# Altium project minesweeper-mainboard.PrjPcb
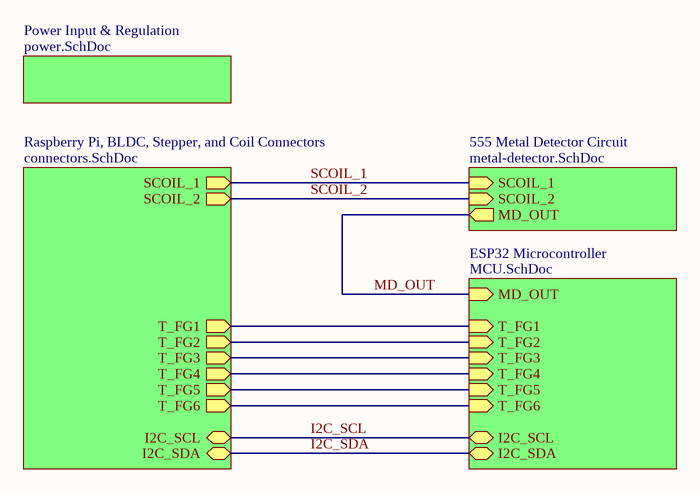
[diagram p0: root.SchDoc]
5 sheets, 137 parts. Net scope: hierarchical (ports join the sheet entries above them; power ports are global).
Board file: mainboard.PcbDoc
Sheets:
  root.SchDoc
    Power Input & Regulation = power.SchDoc
    Raspberry Pi, BLDC, Stepper, and Coil Connectors = connectors.SchDoc
    555 Metal Detector Circuit = metal-detector.SchDoc
    ESP32 Microcontroller = MCU.SchDoc

## Sheet root.SchDoc
size A4; SheetNumber: 1; SheetTotal: 5

### Sub-sheets
555 Metal Detector Circuit = metal-detector.SchDoc: SCOIL_2 (in), MD_OUT (out), SCOIL_1 (in)
ESP32 Microcontroller = MCU.SchDoc: MD_OUT (in), I2C_SCL (bidir), I2C_SDA (bidir), T_FG1 (in), T_FG2 (in), T_FG3 (in), T_FG4 (in), T_FG5 (in), T_FG6 (in)
Power Input & Regulation = power.SchDoc: no entries
Raspberry Pi, BLDC, Stepper, and Coil Connectors = connectors.SchDoc: SCOIL_1 (out), SCOIL_2 (out), I2C_SCL (bidir), I2C_SDA (bidir), T_FG1 (out), T_FG2 (out), T_FG3 (out), T_FG4 (out), T_FG5 (out), T_FG6 (out)

### Nets
I2C_SCL: sheet Raspberry Pi, BLDC, Stepper, and Coil Connectors/I2C_SCL, sheet ESP32 Microcontroller/I2C_SCL
I2C_SDA: sheet Raspberry Pi, BLDC, Stepper, and Coil Connectors/I2C_SDA, sheet ESP32 Microcontroller/I2C_SDA
MD_OUT: sheet 555 Metal Detector Circuit/MD_OUT, sheet ESP32 Microcontroller/MD_OUT
SCOIL_1: sheet Raspberry Pi, BLDC, Stepper, and Coil Connectors/SCOIL_1, sheet 555 Metal Detector Circuit/SCOIL_1
SCOIL_2: sheet Raspberry Pi, BLDC, Stepper, and Coil Connectors/SCOIL_2, sheet 555 Metal Detector Circuit/SCOIL_2
T_FG1: sheet Raspberry Pi, BLDC, Stepper, and Coil Connectors/T_FG1, sheet ESP32 Microcontroller/T_FG1
T_FG2: sheet Raspberry Pi, BLDC, Stepper, and Coil Connectors/T_FG2, sheet ESP32 Microcontroller/T_FG2
T_FG3: sheet Raspberry Pi, BLDC, Stepper, and Coil Connectors/T_FG3, sheet ESP32 Microcontroller/T_FG3
T_FG4: sheet Raspberry Pi, BLDC, Stepper, and Coil Connectors/T_FG4, sheet ESP32 Microcontroller/T_FG4
T_FG5: sheet Raspberry Pi, BLDC, Stepper, and Coil Connectors/T_FG5, sheet ESP32 Microcontroller/T_FG5
T_FG6: sheet Raspberry Pi, BLDC, Stepper, and Coil Connectors/T_FG6, sheet ESP32 Microcontroller/T_FG6

## Sheet power.SchDoc
size A4; SheetNumber: 2; SheetTotal: 5
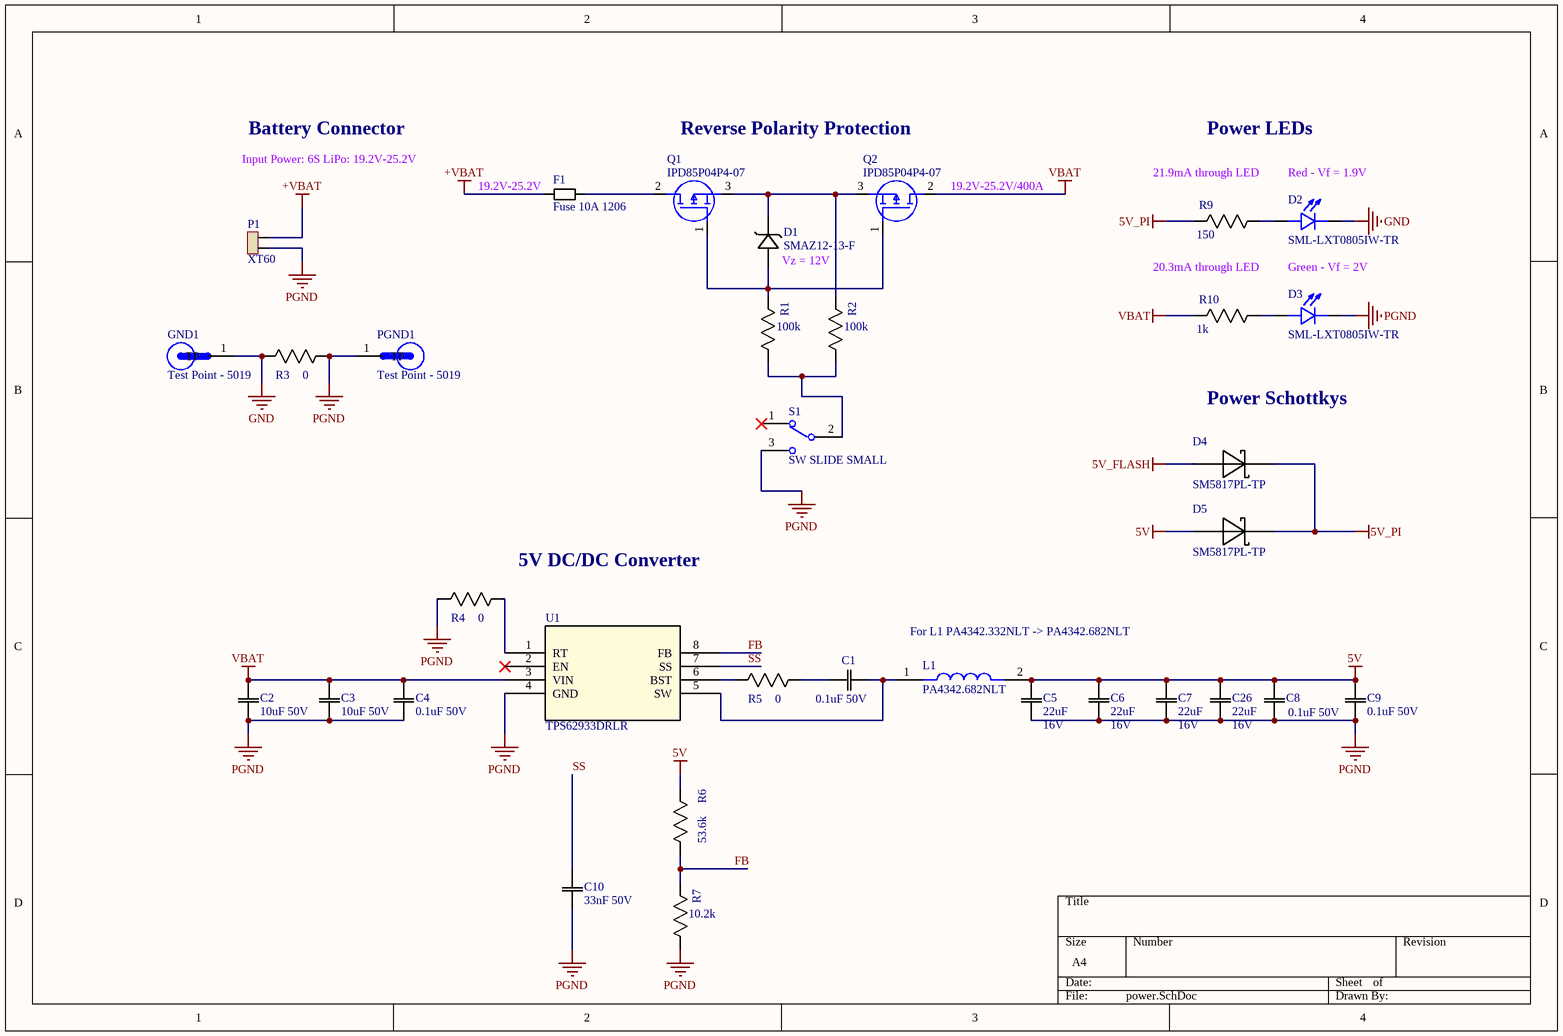
[diagram p1: power.SchDoc]

### Parts
C1  0.1uF 50V  [0805]
C2  10uF 50V  [0805]
C3  10uF 50V  [0805]
C4  0.1uF 50V  [0805]
C5  Rating: 16V  [0805]  (hidden comment: 22uF)
C6  Rating: 16V  [0805]  (hidden comment: 22uF)
C7  Rating: 16V  [0805]  (hidden comment: 22uF)
C8  0.1uF 50V  [0805]
C9  0.1uF 50V  [0805]
C10  33nF 50V  [0805]
C26  Rating: 16V  [0805]  (hidden comment: 22uF)
D1  SMAZ12-13-F  [SMA_DIO-L]
D2  SML-LXT0805IW-TR  [LEDC2012X120N]
D3  SML-LXT0805IW-TR  [LEDC2012X120N]
D4  SM5817PL-TP  [SOD-123]
D5  SM5817PL-TP  [SOD-123]
F1  Fuse 10A 1206  [1206]
GND1  Test Point - 5019  [TP380X203]
L1  PA4342.682NLT  [IND_PA4342.332NLT]
P1  XT60  [Amass_XT60PW-M]
PGND1  Test Point - 5019  [TP380X203]
Q1  IPD85P04P4-07  [DPAK (TO-252)]
Q2  IPD85P04P4-07  [DPAK (TO-252)]
R1  100k  [0805]
R2  100k  [0805]
R3  0  [0805]
R4  0  [0805]
R5  0  [0805]
R6  53.6k  [0805]
R7  10.2k  [0805]
R9  150  [0805]
R10  1k  [0805]
S1  SW SLIDE SMALL  [SW SLIDE SMALL]
U1  TPS62933DRLR  [SOT_33DRLR_TEX]

### Nets
5V: C5.2(C2) C6.2(C2) C7.2(C2) C8.2(C2) C9.2(C2) C26.2(C2) D5.A L1.2 R6.2(R2)
5V_FLASH: D4.A
5V_PI: D4.C(K) D5.C(K) R9.2(R2)
+VBAT: F1.1 P1.2
GND: D2.C GND1.1(TP) R3.2(R2)
PGND: C2.1(C1) C3.1(C1) C4.1(C1) C5.1(C1) C6.1(C1) C7.1(C1) C8.1(C1) C9.1(C1) C10.1(C1) C26.1(C1) D3.C P1.1 PGND1.1(TP) R3.1(R1) R4.2(R2) R7.1(R1) S1.3 U1.4(GND)
VBAT: C2.2(C2) C3.2(C2) C4.2(C2) Q2.2(D) R10.2(R2) U1.3(VIN)
FB: R6.1(R1) R7.2(R2) U1.8(FB)
SS: C10.2(C2) U1.7(SS)
NetC1_1: C1.1(C1) L1.1 U1.5(SW)
NetC1_2: C1.2(C2) R5.1(R1)
NetD1_1: D1.1 Q1.3(S) Q2.3(S) R2.2(R2)
NetD1_2: D1.2 Q1.1(G) Q2.1(G) R1.2(R2)
NetD2_A: D2.A R9.1(R1)
NetD3_A: D3.A R10.1(R1)
NetF1_2: F1.2 Q1.2(D)
NetR1_1: R1.1(R1) R2.1(R1) S1.2
NetR4_1: R4.1(R1) U1.1(RT)
NetR5_2: R5.2(R2) U1.6(BST)

Not connected (* = marked no-connect by the designer): S1 1*; U1 2(EN)*

### Notes on the sheet
- Input Power: 6S LiPo: 19.2V-25.2V
- Battery Connector
- Reverse Polarity Protection
- 21.9mA through LED
- Power LEDs
- Red - Vf = 1.9V
- (near F1) 19.2V-25.2V
- (near Q2) 19.2V-25.2V/400A
- (near D1) Vz = 12V
- 20.3mA through LED
- Green - Vf = 2V
- Power Schottkys
- (near R4) 5V DC/DC Converter
- For L1 PA4342.332NLT -> PA4342.682NLT

### Library data of the parts
C1 C4 C8 C9 = CAP 10uF 50V: Default Symbol for Capacitors; Manufacturer Part Number 1: GRM21BR61H106KE43L; Value: 10uF; Temperature Coefficient: X5R; Tolerance: 10%; Part Number: CAP 10uF 50V; Supplier 1: Digi-Key; Supplier Part Number 1: 490-18663-1-ND; Manufacturer Part Number 2: CL32B106KBJNNWE; Supplier 2: Digi-Key; Supplier Part Number 2: 1276-3388-1-ND; Rating: 50V
C2 C3 = CAP 10uF 50V: Default Symbol for Capacitors; Manufacturer Part Number 1: GRM21BR61H106KE43L; Temperature Coefficient: X5R; Tolerance: 10%; Part Number: CAP 10uF 50V; Supplier 1: Digi-Key; Supplier Part Number 1: 490-18663-1-ND; Manufacturer Part Number 2: CL32B106KBJNNWE; Supplier 2: Digi-Key; Supplier Part Number 2: 1276-3388-1-ND; Value: 10uF; Rating: 50V
C5-C7 C26 = CAP 22uF 16V: CAP CER 22UF 16V X5R 0805; Tolerance: 10%; Package: 0805; Temperature Coefficient: X5R; Operating Temperature: -55°C ~ 85°C; Value: 22uF; Part Number: CAP 22uF 16V
C10 = CAP 33nF 50V: Default Symbol for Capacitors; Tolerance: 5%; Part Number: CAP 33nF 50V; Value: 33nF; Rating: 50V
D1 = DIODE ZENER 12V 1W: Zener Diode 12 V 1 W ±5% Surface Mount SMA; Mfr_Name: Diodes Inc; Type: DEV; Copyright: Copyright (C) 2021 Ultra Librarian. All rights reserved.; Manufacturer_Part_Number: SMAZ12-13-F; Digi-Key_Part_Number_1: SMAZ12-FDICT-ND; Digi-Key_Part_Number_2: SMAZ12-FDIDKR-ND; Digi-Key_Part_Number_3: SMAZ12-FDITR-ND; RefDes: RefDes; Supplier 1: Digi-Key; Supplier 2: Newark; Supplier 3: Digi-Key; Supplier Part Number 1: SMAZ12-FDICT-ND; Supplier Part Number 2: 23T8541; Supplier Part Number 3: SMAZ12-FDICT-ND; Part Number: DIODE ZENER 12V 1W; Manufacturer Part Number 1: SMAZ12-13-F; Supplier URL 1: https://www.digikey.com/en/products/detail/SMAZ12-13-F/SMAZ12-FDICT-ND/725073?curr=usd&utm_campaign=buynow&utm_medium=aggregator&utm_source=octopart
D2 D3 = SML-LXT0805IW-TR: LED;Red;11mcd;0.061In.Dia.;SMD;100mA;2V Vf;635nm;140deg;SMD;White Diffused;5V Vr | Lumex SML-LXT0805IW-TR; MF: Lumex Opto/Components; SnapEDA_Link: https://www.snapeda.com/parts/SML-LXT0805IW-TR/Lumex+Opto%252FComponents+Inc./view-part/?ref=snap; Package: 0805 Lumex; Value: *; MP: SML-LXT0805IW-TR; Check_prices: https://www.snapeda.com/parts/SML-LXT0805IW-TR/Lumex+Opto%252FComponents+Inc./view-part/?ref=eda
D4 D5 = DIODE SCHOTTKY 20V 1A: Diode Schottky 20V 1A Surface Mount SOD-123FL; MF: Micro Commercial Co; ComponentLink1Description: digikey; ComponentLink1URL: https://www.digikey.ca/product-detail/en/on-semiconductor/MBR0540T1G/MBR0540T1GOSCT-ND/917967; Digikey: SM5817PL-TPMSCT-ND; Digikey Link: https://www.digikey.ca/product-detail/en/micro-commercial-co/SM5817PL-TP/SM5817PL-TPMSCT-ND/1793410; MP: SM5817PL-TP; Voltage Rating: 20V; Package: SOD-123; Current Rating: 1A; Part Number: DIODE SCHOTTKY 20V 1A; Supplier URL 1: https://www.digikey.ca/product-detail/en/on-semiconductor/MBR0540T1G/MBR0540T1GOSCT-ND/917967; Pin Count: 2
F1 = FUSE 10A 63V SLOW: FUSE 10A 32V AC 63V DC 1206; Response Time: Slow Blow; Rating: 10A; Voltage Rating - DC: 63V; Operating Temperature: -55°C ~ 90°C; Part Number: FUSE 10A 63V SLOW; Pin Count: 2
GND1 PGND1 = Test Point - 5019: PC Test Point, Miniature Phosphor Bronze, Silver Plating Surface Mount Mounting Type; MP: 5019; MF: Keystone Electronics; Value: *; Package: 2010 Keystone; Part Number: Test Point - 5019
L1 = PA4342.332NLT: FIXED IND 6.8UH 8.5A 23.3MOHM SM; MF: Pulse; Package: Nonstandard Pulse; Price: None; Check_prices: https://www.snapeda.com/parts/PA4342.332NLT/Pulse/view-part/?ref=eda; Value: *; SnapEDA_Link: https://www.snapeda.com/parts/PA4342.332NLT/Pulse/view-part/?ref=snap; MP: PA4342.332NLT; Availability: In Stock; Purchase-URL: https://pricing.snapeda.com/search/part/PA4342.332NLT/?ref=eda
P1 = XT60 Connector: XT60 CONNECTORS FEMALE PAIR; MF: SparkFun Electronics; MP: PRT-10474; Digikey: 1568-1816-ND; Digikey Link: https://www.digikey.ca/product-detail/en/sparkfun-electronics/PRT-10474/1568-1816-ND/8258064; Package: XT60; Price: 2.13000 CAD; Value: N/A; Supplier 1: Digi-Key; Supplier Part Number 1: 1568-1816-ND; Part Number: XT60 Connector; Supplier URL 1: https://www.digikey.ca/product-detail/en/sparkfun-electronics/PRT-10474/1568-1816-ND/8258064; Pin Count: 2
Q1 Q2 = MOSFET IPD85P04P4-07: P-Channel 40 V 85A (Tc) 88W (Tc) Surface Mount PG-TO252-3-313; Supplier 1: Digi-Key; Supplier 2: Mouser; Supplier 3: Digi-Key; Supplier Part Number 1: 448-IPD85P04P407ATMA1CT-ND; Supplier Part Number 2: 726-IPD85P04P4-07; Supplier Part Number 3: 448-IPD85P04P407ATMA1CT-ND; Part Number: MOSFET IPD85P04P4-07; Supplier URL 1: https://www.digikey.ca/en/products/detail/infineon-technologies/IPD85P04P407ATMA1/5960266
R1 R2 = RES 100k 1/8W - 1%: Default Resistor Symbol; Manufacturer Part Number 1: ERJ-H3GJ104V; Power (Watts): 0.125W; Tolerance: 1%; Package: 0805; Value: 100k; Part Number: RES 100k 1/8W - 1%; Supplier 1: Digi-Key; Supplier Part Number 1: 10-ERJ-H3GJ104VCT-ND; Supplier URL 1: https://www.digikey.ca/en/products/detail/panasonic-electronic-components/ERJ-H3GJ104V/13877854?s=N4IgTCBcDaIIwAYC0BRASgKSQCQMwHENEAWANQGEAVJAOQBEQBdAXyA
R3-R5 = RES 0 JUMPER 0603: Default Resistor Symbol; Power (Watts): 0.125W; Package: 0805; Tolerance: N/A; Value: 0; Part Number: RES 0 JUMPER 0603
R6 = RES 56.2k 1/10W: Default Resistor Symbol; Value: 1; Power (Watts): 0.125W; Tolerance: 5%; Package: 0805; Part Number: RES 56.2k 1/10W
R7 = RES 10.2k 1/8W: Default Resistor Symbol; Power (Watts): 0.125W; Tolerance: 5%; Package: 0805; Value: 10.2k; Part Number: RES 10.2k 1/8W
R9 = RES 150.0 1/8W: Default Resistor Symbol; Value: 1; Power (Watts): 0.125W; Tolerance: 5%; Package: 0805; Part Number: RES 150.0 1/8W
R10 = RES 1.1k 1/8W: Default Resistor Symbol; Value: 1; Power (Watts): 0.125W; Tolerance: 5%; Package: 0805; Part Number: RES 1.1k 1/8W
S1 = SW SLIDE SMALL: Slide Switch SPDT Surface Mount, Right Angle; Manufacturer Part Number 1: JS102011SAQN SPDT; MF: C&K; MP: JS102011SAQN; Availability: Unavailable; Price: None; SnapEDA_Link: https://www.snapeda.com/parts/JS102011SAQN/C%26K/view-part/214325/?ref=snap; Value: *; Package: None; Part Number: SW SLIDE SMALL; Supplier 1: Digi-key; Supplier Part Number 1: JS102011SAQN SPDT; Supplier URL 1: https://www.digikey.ca/en/products/detail/c-k/JS102011SAQN/1640095
U1 = XTPS62933DRLR: No Description Available; Mfr_Name: Texas Instruments; RefDes: RefDes; Type: Type

## Sheet connectors.SchDoc
size 431 x 279 mm; SheetNumber: 4; SheetTotal: 5
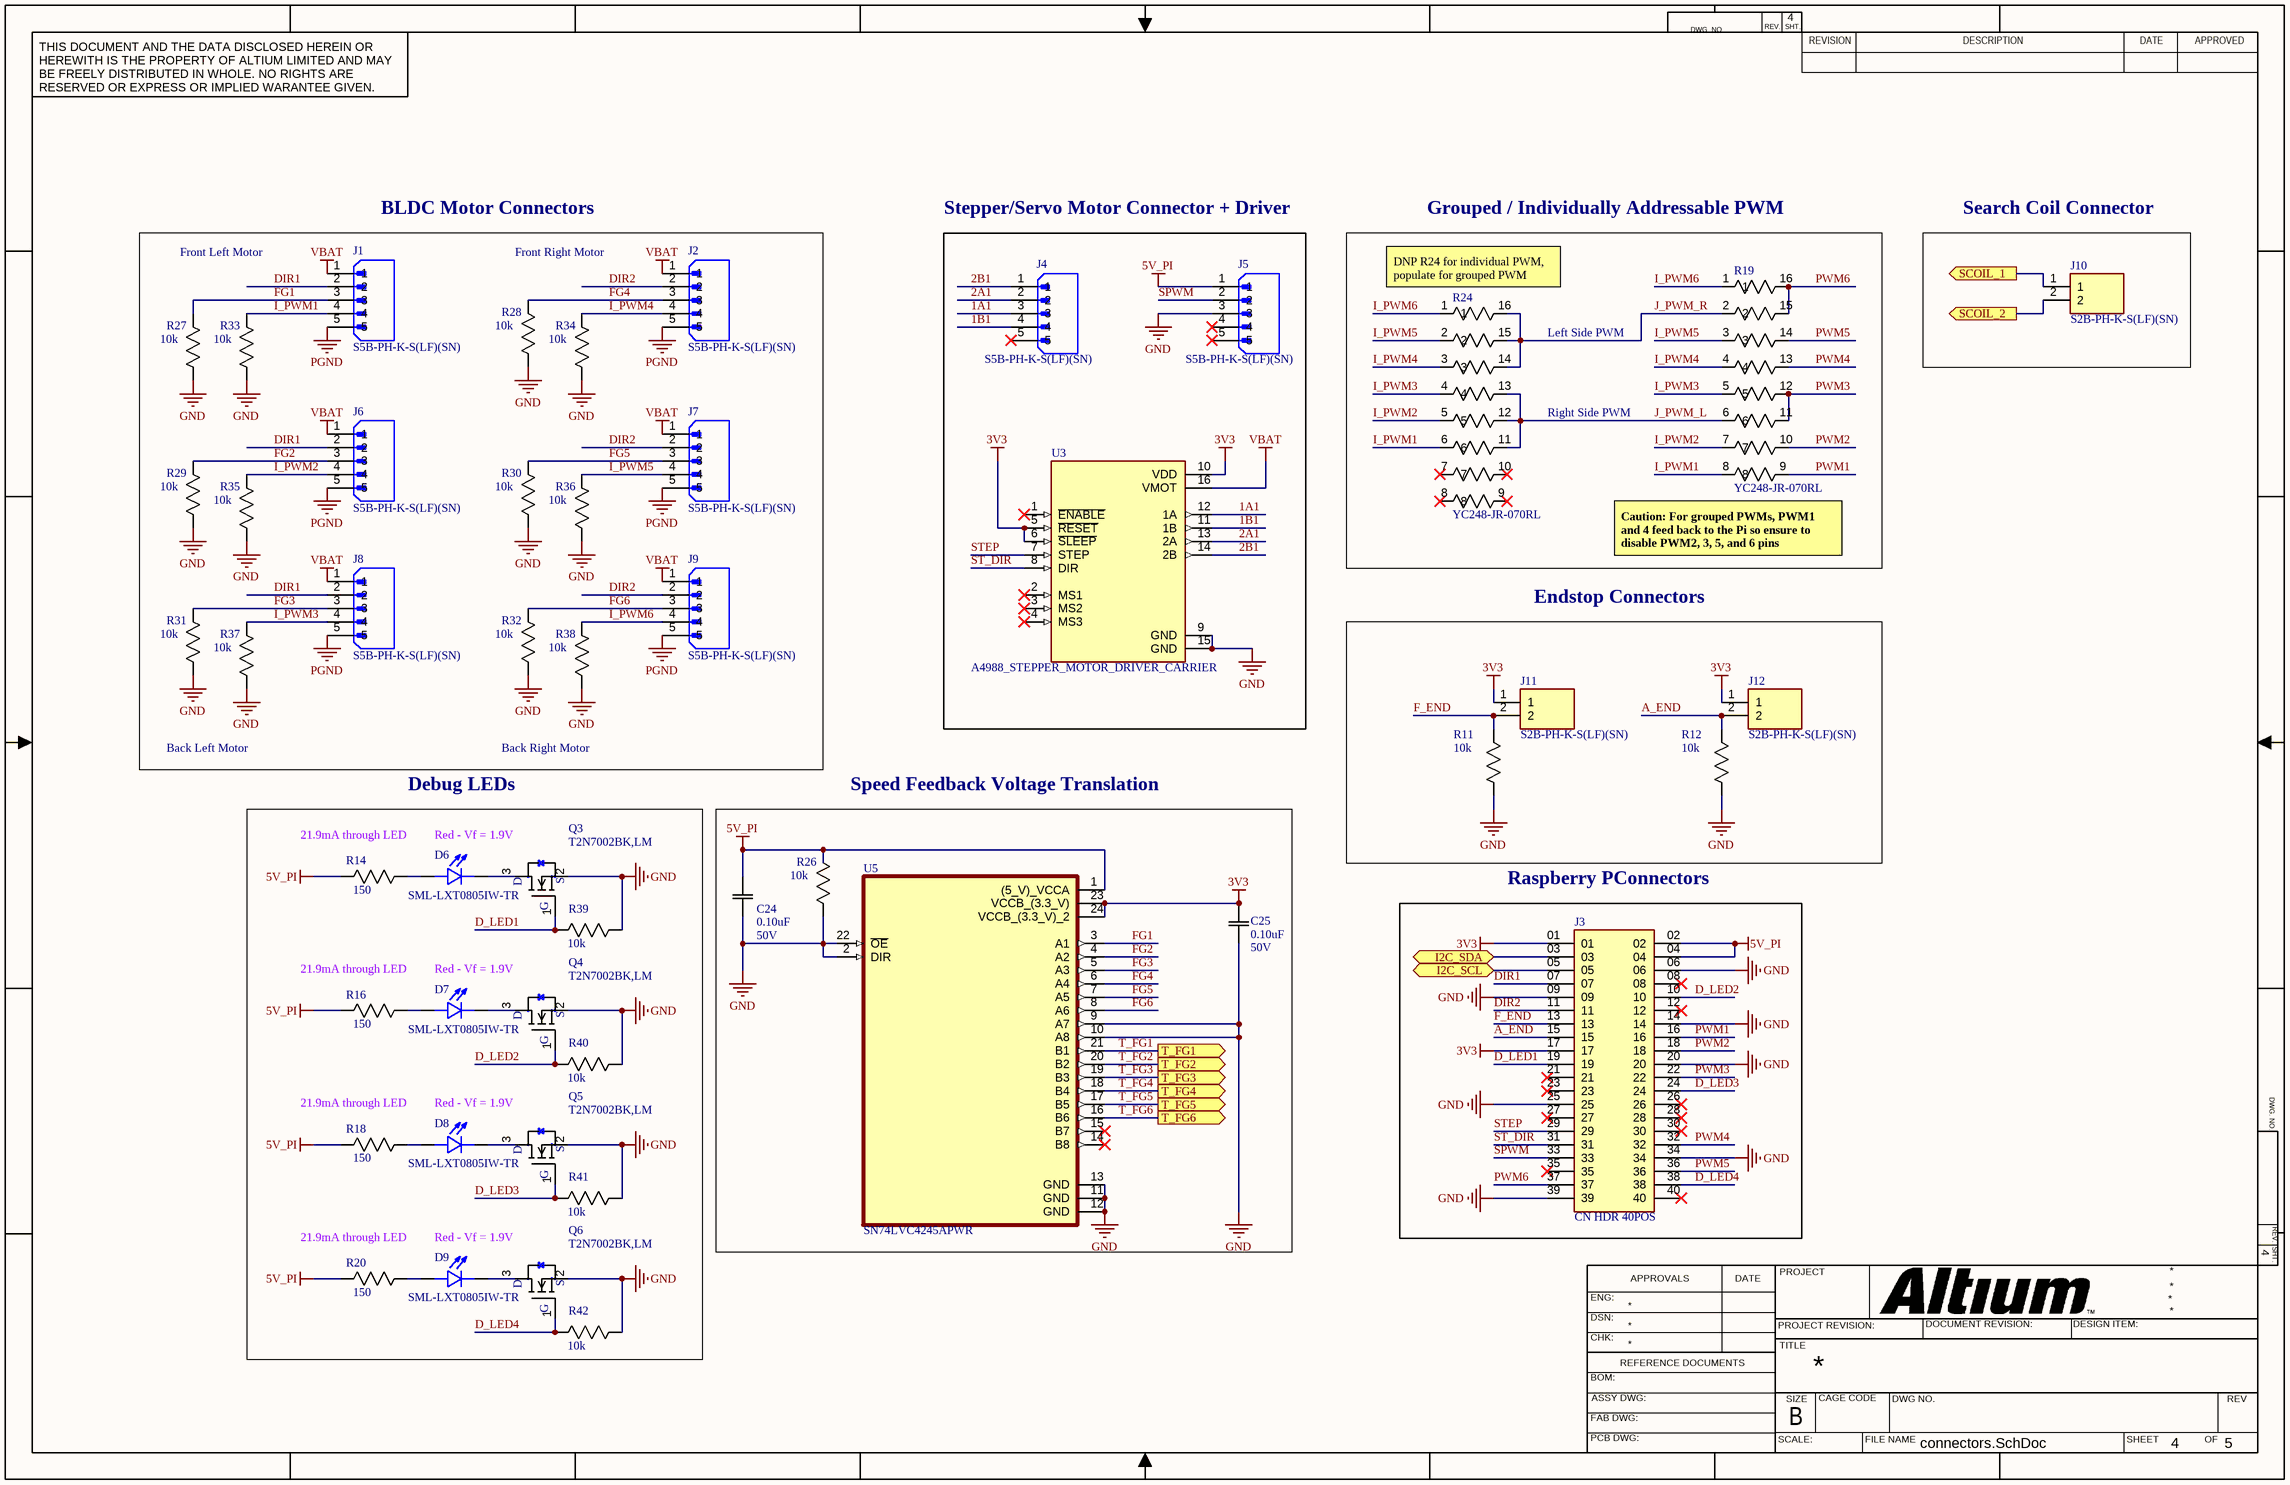
[diagram p2: connectors.SchDoc]

### Parts
C24  Rating: 50V  [0805]  (hidden comment: 0.10uF)
C25  Rating: 50V  [0805]  (hidden comment: 0.10uF)
D6  SML-LXT0805IW-TR  [LEDC2012X120N]
D7  SML-LXT0805IW-TR  [LEDC2012X120N]
D8  SML-LXT0805IW-TR  [LEDC2012X120N]
D9  SML-LXT0805IW-TR  [LEDC2012X120N]
J1  S5B-PH-K-S(LF)(SN)  [JST_S5B-PH-K-S(LF)(SN)]
J2  S5B-PH-K-S(LF)(SN)  [JST_S5B-PH-K-S(LF)(SN)]
J3  CN HDR 40POS  [CN HDR 40POS 0.1 TH]
J4  S5B-PH-K-S(LF)(SN)  [JST_S5B-PH-K-S(LF)(SN)]
J5  S5B-PH-K-S(LF)(SN)  [JST_S5B-PH-K-S(LF)(SN)]
J6  S5B-PH-K-S(LF)(SN)  [JST_S5B-PH-K-S(LF)(SN)]
J7  S5B-PH-K-S(LF)(SN)  [JST_S5B-PH-K-S(LF)(SN)]
J8  S5B-PH-K-S(LF)(SN)  [JST_S5B-PH-K-S(LF)(SN)]
J9  S5B-PH-K-S(LF)(SN)  [JST_S5B-PH-K-S(LF)(SN)]
J10  S2B-PH-K-S(LF)(SN)  [JST_S2B-PH-K-S(LF)(SN)]
J11  S2B-PH-K-S(LF)(SN)  [JST_S2B-PH-K-S(LF)(SN)]
J12  S2B-PH-K-S(LF)(SN)  [JST_S2B-PH-K-S(LF)(SN)]
Q3  T2N7002BK,LM  [SOT23_TOS]
Q4  T2N7002BK,LM  [SOT23_TOS]
Q5  T2N7002BK,LM  [SOT23_TOS]
Q6  T2N7002BK,LM  [SOT23_TOS]
R11  10k  [0805]
R12  10k  [0805]
R14  150  [0805]
R16  150  [0805]
R18  150  [0805]
R19  YC248-JR-070RL  [RES_YC248_4X1P6_YAG-M]
R20  150  [0805]
R24  YC248-JR-070RL  [RES_YC248_4X1P6_YAG-M]
R26  10k  [0805]
R27  10k  [0805]
R28  10k  [0805]
R29  10k  [0805]
R30  10k  [0805]
R31  10k  [0805]
R32  10k  [0805]
R33  10k  [0805]
R34  10k  [0805]
R35  10k  [0805]
R36  10k  [0805]
R37  10k  [0805]
R38  10k  [0805]
R39  10k  [0805]
R40  10k  [0805]
R41  10k  [0805]
R42  10k  [0805]
U3  A4988_STEPPER_MOTOR_DRIVER_CARRIER  [MODULE_A4988_STEPPER_MOTOR_DRIVER_CARRIER]
U5  SN74LVC4245APWR  [SOP65P640X120-24N]

### Blocks framed on the sheet
BLDC Motor Connectors: J1 J2 J6-J9 R27-R38
Stepper/Servo Motor Connector + Driver: J4 J5 U3
Grouped / Individually Addressable PWM: R19 R24
Search Coil Connector: J10
Endstop Connectors: J11 J12 R11 R12
Debug LEDs: D6-D9 Q3-Q6 R14 R16 R18 R20 R39-R42
Speed Feedback Voltage Translation: C24 C25 R26 U5
Raspberry PConnectors: J3

### Ports
I2C_SCL (bidir), I2C_SDA (bidir), SCOIL_1 (out), SCOIL_2 (out), T_FG1 (out), T_FG2 (out), T_FG3 (out), T_FG4 (out), T_FG5 (out), T_FG6 (out)

### Nets
3V3: C25.2(C2) J3.01 J3.17 J11.1 J12.1 U3.5(~{RESET}) U3.6(~{SLEEP}) U3.10(VDD) U5.23(VCCB_(3.3_V)) U5.24(VCCB_(3.3_V)_2)
5V_PI: C24.2(C2) J3.02 J3.04 J5.1 R14.2(R2) R16.2(R2) R18.2(R2) R20.2(R2) R26.1(R1) U5.1((5_V)_VCCA)
GND: C24.1(C1) C25.1(C1) J3.06 J3.09 J3.14 J3.20 J3.25 J3.34 J3.39 J5.3 Q3.2(S) Q4.2(S) Q5.2(S) Q6.2(S) R11.1(R1) R12.1(R1) R26.2(R2) R27.2(R2) R28.2(R2) R29.2(R2) R30.2(R2) R31.2(R2) R32.2(R2) R33.2(R2) R34.2(R2) R35.2(R2) R36.2(R2) R37.2(R2) R38.2(R2) R39.1(R1) R40.1(R1) R41.1(R1) R42.1(R1) U3.9(GND) U3.15(GND) U5.2(DIR) U5.9(A7) U5.10(A8) U5.11(GND) U5.12(GND) U5.13(GND) U5.22(~{OE})
PGND: J1.5 J2.5 J6.5 J7.5 J8.5 J9.5
VBAT: J1.1 J2.1 J6.1 J7.1 J8.1 J9.1 U3.16(VMOT)
1A1: J4.3 U3.12(1A)
1B1: J4.4 U3.11(1B)
2A1: J4.2 U3.13(2A)
2B1: J4.1 U3.14(2B)
A_END: J3.15 J12.2 R12.2(R2)
D_LED1: J3.19 Q3.1(G) R39.2(R2)
D_LED2: J3.10 Q4.1(G) R40.2(R2)
D_LED3: J3.24 Q5.1(G) R41.2(R2)
D_LED4: J3.38 Q6.1(G) R42.2(R2)
DIR1: J1.2 J3.07 J6.2 J8.2
DIR2: J2.2 J3.11 J7.2 J9.2
F_END: J3.13 J11.2 R11.2(R2)
FG1: J1.3 R27.1(R1) U5.3(A1)
FG2: J6.3 R29.1(R1) U5.4(A2)
FG3: J8.3 R31.1(R1) U5.5(A3)
FG4: J2.3 R28.1(R1) U5.6(A4)
FG5: J7.3 R30.1(R1) U5.7(A5)
FG6: J9.3 R32.1(R1) U5.8(A6)
I2C_SCL: J3.05 ; port I2C_SCL
I2C_SDA: J3.03 ; port I2C_SDA
I_PWM1: J1.4 R19.8 R24.6 R33.1(R1)
I_PWM2: J6.4 R19.7 R24.5 R35.1(R1)
I_PWM3: J8.4 R19.5 R24.4 R37.1(R1)
I_PWM4: J2.4 R19.4 R24.3 R34.1(R1)
I_PWM5: J7.4 R19.3 R24.2 R36.1(R1)
I_PWM6: J9.4 R19.1 R24.1 R38.1(R1)
J_PWM_L: R19.6 R24.11 R24.12 R24.13
J_PWM_R: R19.2 R24.14 R24.15 R24.16
PWM1: J3.16 R19.9
PWM2: J3.18 R19.10
PWM3: J3.22 R19.11 R19.12
PWM4: J3.32 R19.13
PWM5: J3.36 R19.14
PWM6: J3.37 R19.15 R19.16
SCOIL_1: J10.1 ; port SCOIL_1
SCOIL_2: J10.2 ; port SCOIL_2
SPWM: J3.33 J5.2
ST_DIR: J3.31 U3.8(DIR)
STEP: J3.29 U3.7(STEP)
T_FG1: U5.21(B1) ; port T_FG1
T_FG2: U5.20(B2) ; port T_FG2
T_FG3: U5.19(B3) ; port T_FG3
T_FG4: U5.18(B4) ; port T_FG4
T_FG5: U5.17(B5) ; port T_FG5
T_FG6: U5.16(B6) ; port T_FG6
NetD6_A: D6.A R14.1(R1)
NetD6_C: D6.C Q3.3(D)
NetD7_A: D7.A R16.1(R1)
NetD7_C: D7.C Q4.3(D)
NetD8_A: D8.A R18.1(R1)
NetD8_C: D8.C Q5.3(D)
NetD9_A: D9.A R20.1(R1)
NetD9_C: D9.C Q6.3(D)

Not connected (* = marked no-connect by the designer): J3 08* 12* 21* 23* 26* 27* 28* 30* 35* 40*; J4 5*; J5 4* 5*; R24 7* 8* 9* 10*; U3 1(~{ENABLE})* 2(MS1)* 3(MS2)* 4(MS3)*; U5 14(B8)* 15(B7)*

### Notes on the sheet
- Front Left Motor
- Front Right Motor
- (near R24) DNP R24 for individual PWM, populate for grouped PWM
- Left Side PWM
- Right Side PWM
- (near R19) Caution: For grouped PWMs, PWM1 and 4 feed back to the Pi so ensure to disable PWM2, 3, 5, and 6 pins
- Back Left Motor
- Back Right Motor
- 21.9mA through LED
- Red - Vf = 1.9V
- DWG. NO.
- REV.
- SHT.
- THIS DOCUMENT AND THE DATA DISCLOSED HEREIN OR HEREWITH IS THE PROPERTY OF ALTIUM LIMITED AND MAY BE FREELY DISTRIBUTED IN WHOLE. NO RIGHTS ARE RESERVED OR EXPRESS OR IMPLIED WARANTEE GIVEN.
- REVISION
- DESCRIPTION
- DATE
- APPROVED
- ENG:
- APPROVALS
- PROJECT
- DSN:
- CHK:
- REFERENCE DOCUMENTS
- PROJECT REVISION:
- TITLE
- DOCUMENT REVISION:
- DESIGN ITEM:
- BOM:
- FAB DWG:
- PCB DWG:
- ASSY DWG:
- SCALE:
- SIZE
- B
- CAGE CODE
- FILE NAME
- DWG NO.
- SHEET
- OF
- REV

### Library data of the parts
C24 C25 = CAP 0.1uF 50V: Default Symbol for Capacitors; Temperature Coefficient: X7R; Tolerance: 10%; Value: 0.10uF; Part Number: CAP 0.1uF 50V
D6-D9 = SML-LXT0805IW-TR: as D2 on sheet power; SnapEDA_Link: https://www.snapeda.com/parts/SML-LXT0805IW-TR/Lumex+Opto%252FComponents+Inc./view-part/?ref=snap; Package: 0805 Lumex; Value: *; MP: SML-LXT0805IW-TR; Check_prices: https://www.snapeda.com/parts/SML-LXT0805IW-TR/Lumex+Opto%252FComponents+Inc./view-part/?ref=eda
J1 J2 J4-J9 = S5B-PH-K-S(LF)(SN): Connector Header Through Hole, Right Angle 5 position 0.079 (2.00mm); MF: JST Sales America Inc.; Package: NON STANDARD-5 J.S.T.; Price: None; Check_prices: https://www.snapeda.com/parts/S5B-PH-K-S(LF)(SN)/JST+Sales+America+Inc./view-part/?ref=eda; Value: *; SnapEDA_Link: https://www.snapeda.com/parts/S5B-PH-K-S(LF)(SN)/JST+Sales+America+Inc./view-part/?ref=snap; MP: S5B-PH-K-S(LF)(SN); Availability: In Stock; Purchase-URL: https://pricing.snapeda.com/search/part/S5B-PH-K-S(LF)(SN)/?ref=eda
J3 = CN HDR 40POS: 40 Position Header Connector; Part Number: CN HDR 40POS; Supplier 1: Digi-Key; Supplier Part Number 1: S6104-ND; Supplier URL 1: https://www.digikey.ca/en/products/detail/sullins-connector-solutions/PPTC202LFBN-RC/807240?s=N4IgTCBcDaIMoDYCMAGALAWgHIBEQF0BfIA; Pin Count: 40
J10-J12 = S2B-PH-K-S(LF)(SN): Connector Header Through Hole, Right Angle 2 position; MF: JST Sales America Inc.; Price: None; Availability: In Stock; Package: None; MP: S2B-PH-K-S(LF)(SN); Value: *; SnapEDA_Link: https://www.snapeda.com/parts/S2B-PH-K-S(LF)(SN)/JST+Sales+America+Inc./view-part/?ref=snap; Purchase-URL: https://pricing.snapeda.com/search/part/S2B-PH-K-S(LF)(SN)/?ref=eda; Check_prices: https://www.snapeda.com/parts/S2B-PH-K-S(LF)(SN)/JST+Sales+America+Inc./view-part/?ref=eda
Q3-Q6 = T2N7002BK,LM: No Description Available; Mfr_Name: Toshiba Electronic Devices & Storage Corp.; RefDes: RefDes; Type: Type
R11 R12 = RES 10k 1/8W - 1%: RES SMD 10K OHM 1% 1/8W 0603; Manufacturer Part Number 1: ERJ-H3GJ103V; Power (Watts): 0.125W; Tolerance: 5%; Package: 0805; Value: 10k; Part Number: RES 10k 1/8W - 1%; Supplier 1: Digi-Key; Supplier Part Number 1: 10-ERJ-H3GJ103VCT-ND; Supplier URL 1: https://www.digikey.ca/en/products/detail/panasonic-electronic-components/ERJ-H3GJ103V/13877876?s=N4IgTCBcDaIIwAYC0BRASgKSQCQMwHENFcA1AYQBUkA5AERAF0BfIA; Manufacturer Part Number 2: RMCF0805JT10K0; Supplier 2: Digi-Key; Supplier Part Number 2: RMCF0805JT10K0CT-ND; Supplier URL 2: https://www.digikey.ca/en/products/detail/stackpole-electronics-inc/RMCF0805JT10K0/1757762?s=N4IgTCBcDaIEoFkDCAxADADjQVgFIBUBGNAaTSXxAF0BfIA; Tolerance 2: 5%
R14 R16 R18 R20 = RES 150.0 1/8W: Default Resistor Symbol; Power (Watts): 0.125W; Tolerance: 5%; Package: 0805; Value: 150; Part Number: RES 150.0 1/8W
R19 R24 = YC248-JR-070RL: No Description Available; Mfr_Name: Yageo
R26-R42 = RES 10k 1/8W - 1%: Default Resistor Symbol; Manufacturer Part Number 1: ERJ-H3GJ103V; Power (Watts): 0.125W; Tolerance: 5%; Package: 0805; Value: 10k; Part Number: RES 10k 1/8W - 1%; Supplier 1: Digi-Key; Supplier Part Number 1: 10-ERJ-H3GJ103VCT-ND; Supplier URL 1: https://www.digikey.ca/en/products/detail/panasonic-electronic-components/ERJ-H3GJ103V/13877876?s=N4IgTCBcDaIIwAYC0BRASgKSQCQMwHENFcA1AYQBUkA5AERAF0BfIA; Manufacturer Part Number 2: RMCF0805JT10K0; Supplier 2: Digi-Key; Supplier Part Number 2: RMCF0805JT10K0CT-ND; Supplier URL 2: https://www.digikey.ca/en/products/detail/stackpole-electronics-inc/RMCF0805JT10K0/1757762?s=N4IgTCBcDaIEoFkDCAxADADjQVgFIBUBGNAaTSXxAF0BfIA; Tolerance 2: 5%
U3 = A4988_STEPPER_MOTOR_DRIVER_CARRIER: Stepper motor controler; IC: A4988; 1A; Uin mot: 8Ã·35V; Price: None; Value: *; MP: A4988_STEPPER_MOTOR_DRIVER_CARRIER; Package: None; Availability: Unavailable
U5 = SN74LVC4245APWR: 24-TSSOP -40 ~ 85; MF: Texas Instruments; MP: SN74LVC4245APWR; DigiKey-Purchase-URL: https://snapeda.com/shop?store=DigiKey&id=235354; Package: TSSOP-24 Texas Instruments; Availability: Good; Price: None; Mouser-Purchase-URL: https://snapeda.com/shop?store=Mouser&id=235354; Texas_Instruments-Purchase-URL: https://snapeda.com/shop?store=Texas+Instruments&id=235354; SnapEDA_Link: https://www.snapeda.com/parts/SN74LVC4245APWR/Texas%20Instruments/view-part/235354/?ref=snap; Value: *; BuyPart: https://www.snapeda.com/parts/SN74LVC4245APWR/Texas%20Instruments/view-part/235354/?ref=eda

## Sheet metal-detector.SchDoc
size A4; SheetNumber: 3; SheetTotal: 5
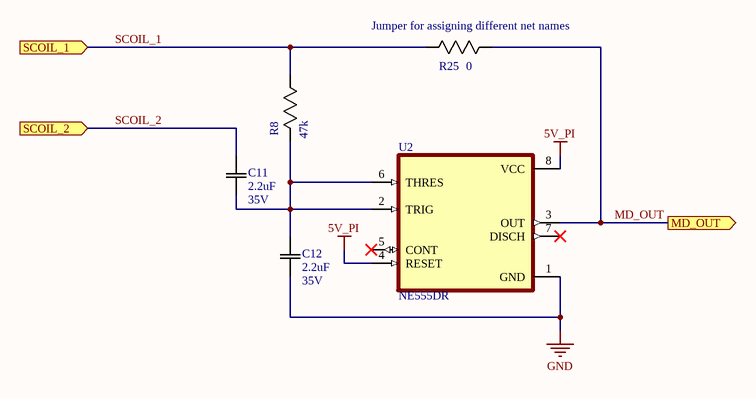
[diagram p3: metal-detector.SchDoc]

### Parts
C11  Rating: 35V  [0805]  (hidden comment: 2.2uF)
C12  Rating: 35V  [0805]  (hidden comment: 2.2uF)
R8  47k  [0805]
R25  0  [0805]
U2  NE555DR  [SOIC127P599X175-8N]

### Ports
MD_OUT (out), SCOIL_1 (in), SCOIL_2 (in)

### Nets
5V_PI: U2.4(RESET) U2.8(VCC)
GND: C12.1(C1) U2.1(GND)
MD_OUT: R25.1(R1) U2.3(OUT) ; port MD_OUT
SCOIL_1: R8.1(R1) R25.2(R2) ; port SCOIL_1
SCOIL_2: C11.2(C2) ; port SCOIL_2
NetC11_1: C11.1(C1) C12.2(C2) R8.2(R2) U2.2(TRIG) U2.6(THRES)

Not connected (* = marked no-connect by the designer): U2 5(CONT)* 7(DISCH)*

### Notes on the sheet
- (near R25) Jumper for assigning different net names

### Library data of the parts
C11 C12 = CAP 2.2uF 35V: CAP CER 2.2UF 35V X7R 0603/0805; Manufacturer Part Number 1: C1608X5R1V225K080AC; Tolerance: 10%; Temperature Coefficient: X5R; Package: 0603/0805; Operating Temperature: -55°C ~ 125°C; Value: 2.2uF; Part Number: CAP 2.2uF 35V; Supplier 1: Digi-Key; Supplier Part Number 1: 445-8025-1-ND; Manufacturer Part Number 2: CGA4J1X7R1V225K125AE; Supplier 2: Digi-Key; Supplier Part Number 2: 445-8787-1-ND
R8 = RES 47k 1/8W - 1%: RES SMD 47K OHM 1% 1/8W 0603; Manufacturer Part Number 1: MCT06030C4702FP500; Power (Watts): 0.125W; Package: 0805; Value: 47k; Tolerance: 1%; Part Number: RES 47k 1/8W - 1%; Supplier 1: Digi-Key; Supplier Part Number 1: MCT0603-47.0K-CFCT-ND; Supplier URL 1: https://www.digikey.ca/en/products/detail/vishay-beyschlag-draloric-bc-components/MCT06030C4702FP500/2607854?s=N4IgTCBcDaILIGEAqAGAbCgzAWgCwHYA6FAaWwQDFlsA5AERAF0BfIA
R25 = RES 0 JUMPER 0603: as R3 on sheet power; Package: 0805; Tolerance: N/A; Value: 0; Part Number: RES 0 JUMPER 0603
U2 = NE555DR: MF: {'manufacturer': u'Texas Instruments'}; Package: None; Price: None; Value: *; MP: NE555DR; Availability: Unavailable

## Sheet MCU.SchDoc
size 431 x 279 mm; SheetNumber: 5; SheetTotal: 5
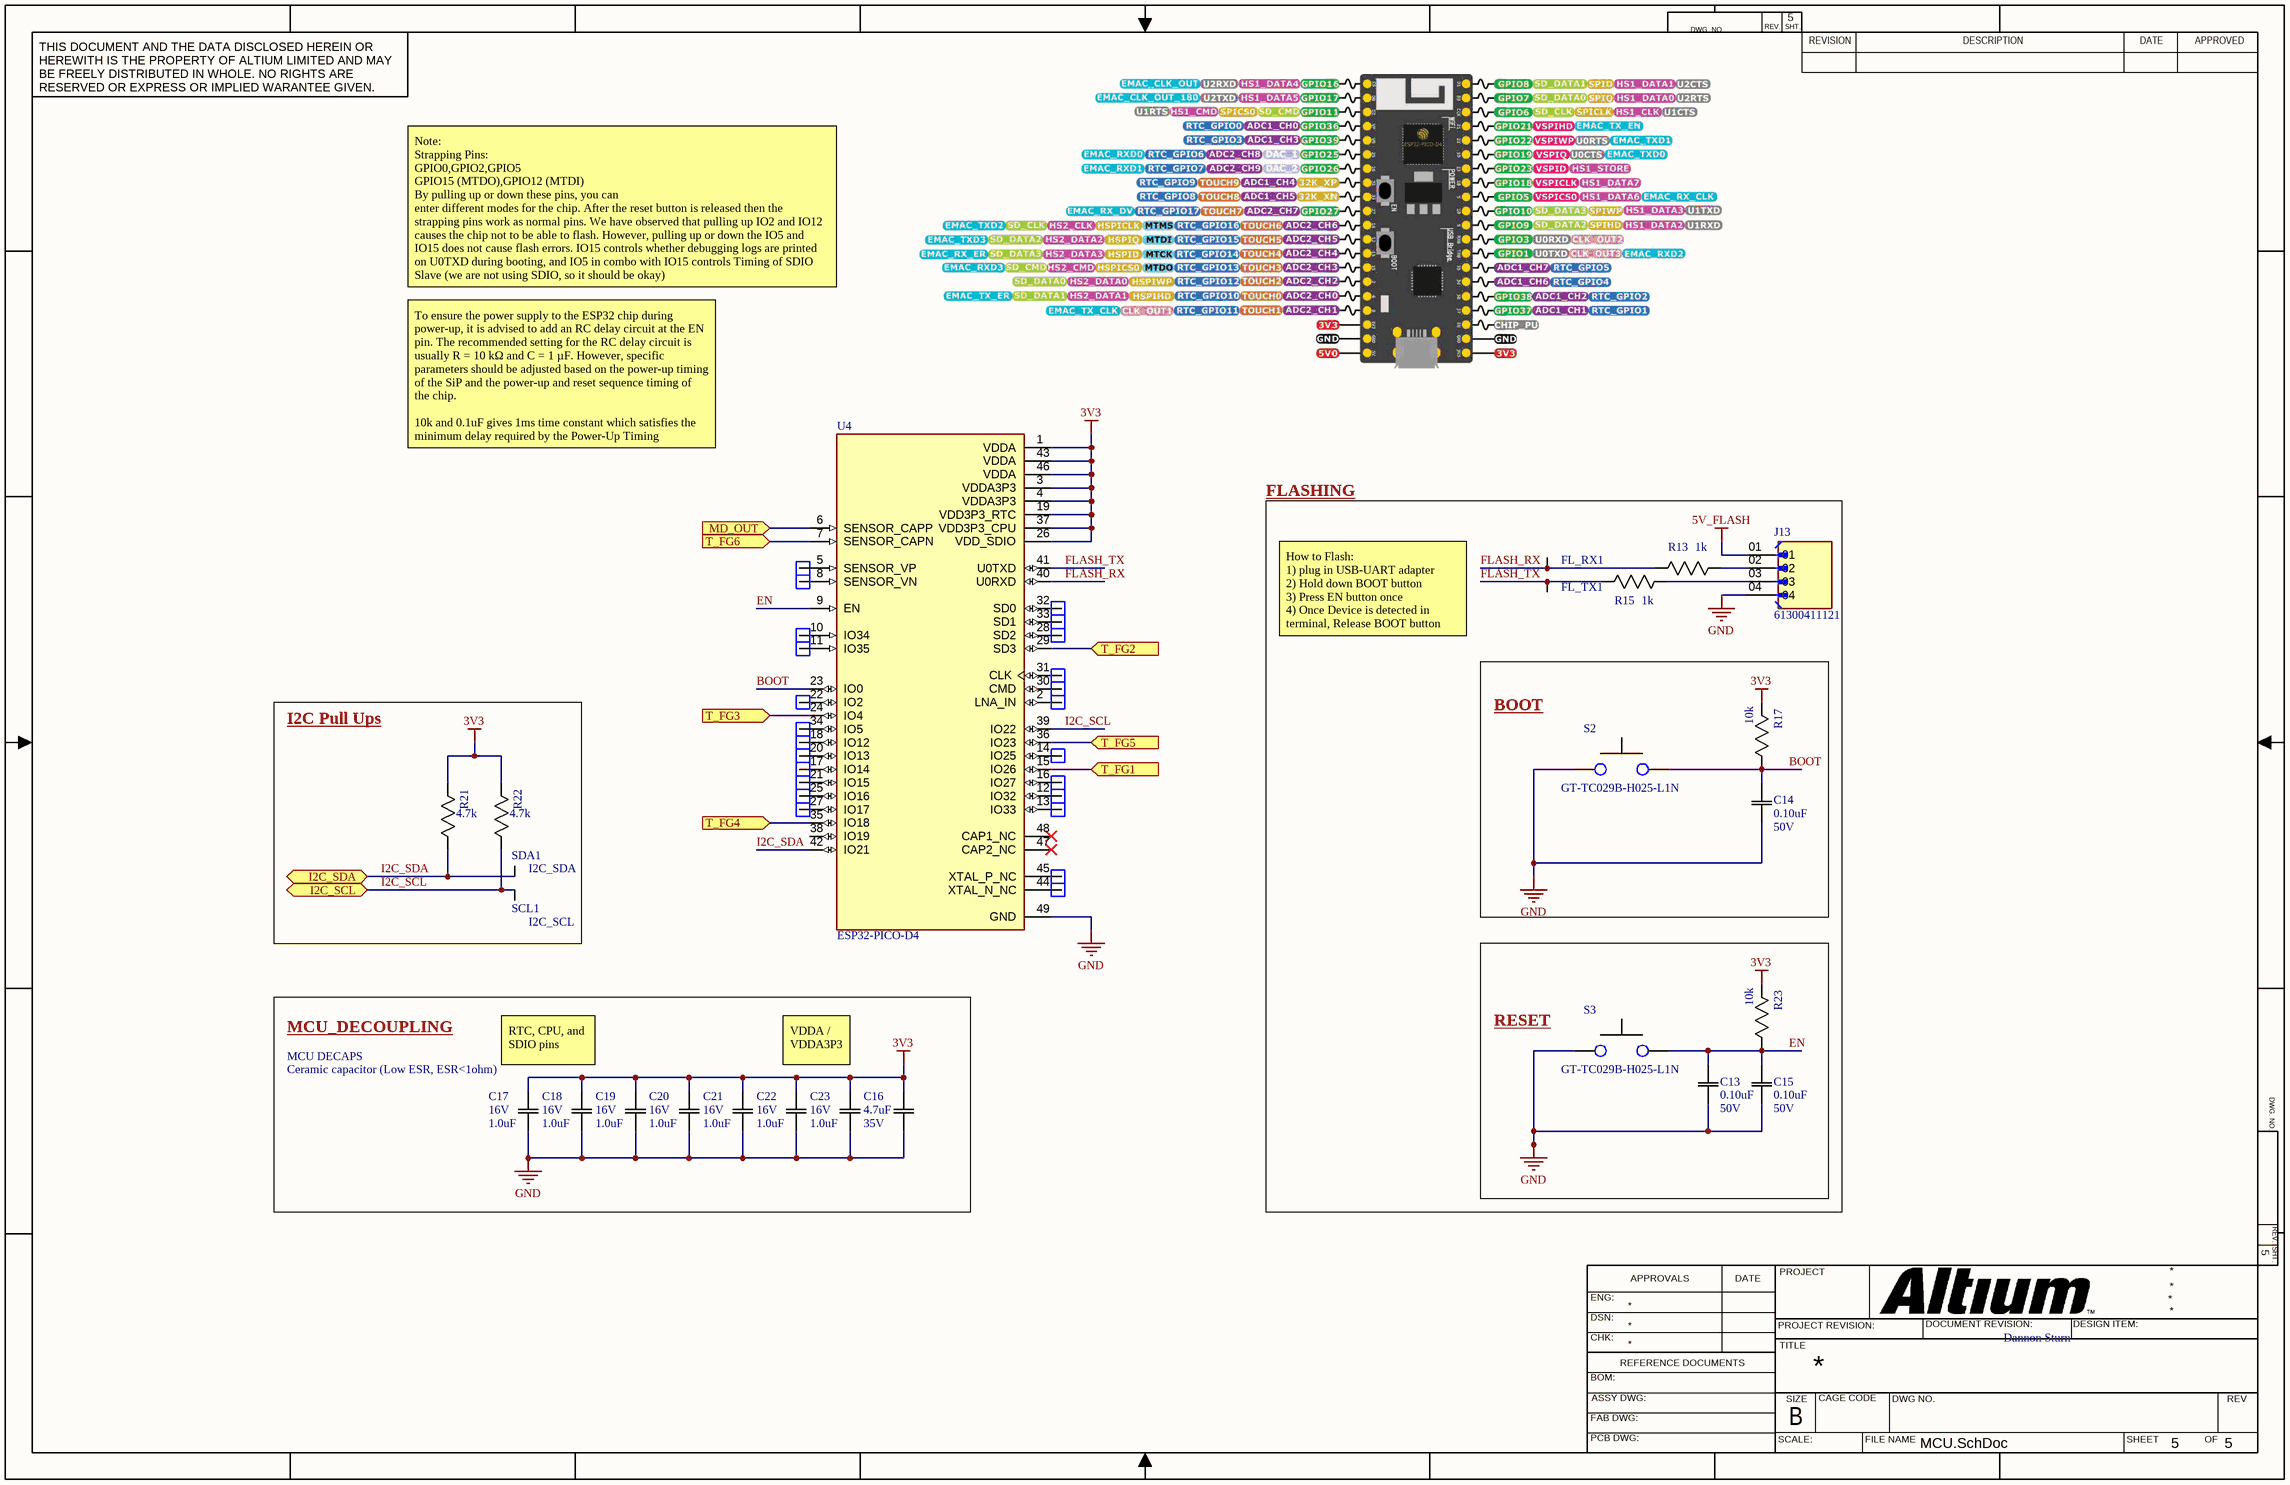
[diagram p4: MCU.SchDoc]

### Parts
1  Breakout Pin 0603  [BreakoutPin 0603]  (value not drawn)
2  Breakout Pin 0603  [BreakoutPin 0603]  (value not drawn)
3  Breakout Pin 0603  [BreakoutPin 0603]  (value not drawn)
4  Breakout Pin 0603  [BreakoutPin 0603]  (value not drawn)
5  Breakout Pin 0603  [BreakoutPin 0603]  (value not drawn)
6  Breakout Pin 0603  [BreakoutPin 0603]  (value not drawn)
7  Breakout Pin 0603  [BreakoutPin 0603]  (value not drawn)
8  Breakout Pin 0603  [BreakoutPin 0603]  (value not drawn)
9  Breakout Pin 0603  [BreakoutPin 0603]  (value not drawn)
10  Breakout Pin 0603  [BreakoutPin 0603]  (value not drawn)
11  Breakout Pin 0603  [BreakoutPin 0603]  (value not drawn)
12  Breakout Pin 0603  [BreakoutPin 0603]  (value not drawn)
13  Breakout Pin 0603  [BreakoutPin 0603]  (value not drawn)
14  Breakout Pin 0603  [BreakoutPin 0603]  (value not drawn)
15  Breakout Pin 0603  [BreakoutPin 0603]  (value not drawn)
16  Breakout Pin 0603  [BreakoutPin 0603]  (value not drawn)
17  Breakout Pin 0603  [BreakoutPin 0603]  (value not drawn)
18  Breakout Pin 0603  [BreakoutPin 0603]  (value not drawn)
19  Breakout Pin 0603  [BreakoutPin 0603]  (value not drawn)
20  Breakout Pin 0603  [BreakoutPin 0603]  (value not drawn)
21  Breakout Pin 0603  [BreakoutPin 0603]  (value not drawn)
22  Breakout Pin 0603  [BreakoutPin 0603]  (value not drawn)
23  Breakout Pin 0603  [BreakoutPin 0603]  (value not drawn)
24  Breakout Pin 0603  [BreakoutPin 0603]  (value not drawn)
C13  Rating: 50V  [0603]  (hidden comment: 0.10uF)
C14  Rating: 50V  [0603]  (hidden comment: 0.10uF)
C15  Rating: 50V  [0805]  (hidden comment: 0.10uF)
C16  Rating: 35V  [0603]  (hidden comment: 4.7uF)
C17  Rating: 16V  [0603]  (hidden comment: 1.0uF)
C18  Rating: 16V  [0603]  (hidden comment: 1.0uF)
C19  Rating: 16V  [0603]  (hidden comment: 1.0uF)
C20  Rating: 16V  [0603]  (hidden comment: 1.0uF)
C21  Rating: 16V  [0603]  (hidden comment: 1.0uF)
C22  Rating: 16V  [0603]  (hidden comment: 1.0uF)
C23  Rating: 16V  [0603]  (hidden comment: 1.0uF)
FL_RX1  Test Point (Via)  [TP]  (value not drawn)  (no BOM)
FL_TX1  Test Point (Via)  [TP]  (value not drawn)  (no BOM)
J13  61300411121  [WURTH_61300411121]
R13  1k  [0603]
R15  1k  [0603]
R17  10k  [0603]
R21  4.7k  [0805]
R22  4.7k  [0805]
R23  10k  [0603]
S2  GT-TC029B-H025-L1N  [SW_EVP-AWCD4A]
S3  GT-TC029B-H025-L1N  [SW_EVP-AWCD4A]
SCL1  I2C_SCL  [TP]  (no BOM)
SDA1  I2C_SDA  [TP]  (no BOM)
U4  ESP32-PICO-D4  [PQFN50P700X700X104-49N - BigPads]

### Blocks framed on the sheet
FLASHING: FL_RX1 FL_TX1 J13 R13 R15
BOOT: C14 R17 S2
I2C Pull Ups: R21 R22 SCL1 SDA1
RESET: C13 C15 R23 S3
MCU_DECOUPLING: C16-C23

### Ports
I2C_SCL (bidir), I2C_SDA (bidir), MD_OUT (in), T_FG1 (in), T_FG2 (in), T_FG3 (in), T_FG4 (in), T_FG5 (in), T_FG6 (in)

### Nets
3V3: C16.2(C2) C17.2(C2) C18.2(C2) C19.2(C2) C20.2(C2) C21.2(C2) C22.2(C2) C23.2(C2) R17.2(R2) R21.2(R2) R22.2(R2) R23.2(R2) U4.1(VDDA) U4.3(VDDA3P3) U4.4(VDDA3P3) U4.19(VDD3P3_RTC) U4.26(VDD_SDIO) U4.37(VDD3P3_CPU) U4.43(VDDA) U4.46(VDDA)
5V_FLASH: J13.01
GND: C13.1(C1) C14.1(C1) C15.1(C1) C16.1(C1) C17.1(C1) C18.1(C1) C19.1(C1) C20.1(C1) C21.1(C1) C22.1(C1) C23.1(C1) J13.04 S2.1 S3.1 U4.49(GND)
BOOT: C14.2(C2) R17.1(R1) S2.2 U4.23(IO0)
EN: C13.2(C2) C15.2(C2) R23.1(R1) S3.2 U4.9(EN)
FLASH_RX: FL_RX1.1 R13.2(R2) U4.40(U0RXD)
FLASH_TX: FL_TX1.1 R15.2(R2) U4.41(U0TXD)
I2C_SCL: R22.1(R1) SCL1.1 U4.39(IO22) ; port I2C_SCL
I2C_SDA: R21.1(R1) SDA1.1 U4.42(IO21) ; port I2C_SDA
MD_OUT: U4.6(SENSOR_CAPP) ; port MD_OUT
T_FG1: U4.15(IO26) ; port T_FG1
T_FG2: U4.29(SD3) ; port T_FG2
T_FG3: U4.24(IO4) ; port T_FG3
T_FG4: U4.35(IO18) ; port T_FG4
T_FG5: U4.36(IO23) ; port T_FG5
T_FG6: U4.7(SENSOR_CAPN) ; port T_FG6
Net1_1: 1.1(BRKOUT) U4.5(SENSOR_VP)
Net2_1: 2.1(BRKOUT) U4.8(SENSOR_VN)
Net3_1: 3.1(BRKOUT) U4.10(IO34)
Net4_1: 4.1(BRKOUT) U4.32(SD0)
Net5_1: 5.1(BRKOUT) U4.11(IO35)
Net6_1: 6.1(BRKOUT) U4.33(SD1)
Net7_1: 7.1(BRKOUT) U4.22(IO2)
Net8_1: 8.1(BRKOUT) U4.31(CLK)
Net9_1: 9.1(BRKOUT) U4.30(CMD)
Net10_1: 10.1(BRKOUT) U4.2(LNA_IN)
Net11_1: 11.1(BRKOUT) U4.18(IO12)
Net12_1: 12.1(BRKOUT) U4.28(SD2)
Net13_1: 13.1(BRKOUT) U4.25(IO16)
Net14_1: 14.1(BRKOUT) U4.27(IO17)
Net15_1: 15.1(BRKOUT) U4.34(IO5)
Net16_1: 16.1(BRKOUT) U4.45(XTAL_P_NC)
Net17_1: 17.1(BRKOUT) U4.44(XTAL_N_NC)
Net18_1: 18.1(BRKOUT) U4.20(IO13)
Net19_1: 19.1(BRKOUT) U4.17(IO14)
Net20_1: 20.1(BRKOUT) U4.21(IO15)
Net21_1: 21.1(BRKOUT) U4.16(IO27)
Net22_1: 22.1(BRKOUT) U4.12(IO32)
Net23_1: 23.1(BRKOUT) U4.13(IO33)
Net24_1: 24.1(BRKOUT) U4.14(IO25)
NetJ13_02: J13.02 R13.1(R1)
NetJ13_03: J13.03 R15.1(R1)

Not connected (* = marked no-connect by the designer): U4 38(IO19) 47(CAP2_NC)* 48(CAP1_NC)*

### Notes on the sheet
- Note:
  Strapping Pins:
  GPIO0,GPIO2,GPIO5
  GPIO15 (MTDO),GPIO12 (MTDI)
  By pulling up or down these pins, you can
  enter different modes for the chip. After the reset button is released then the strapping pins work as normal pins. We have observed that pulling up IO2 and IO12 causes the chip not to be able to flash. However, pulling up or down the IO5 and IO15 does not cause flash errors. IO15 controls whether debugging logs are printed on U0TXD during booting, and IO5 in combo with IO15 controls Timing of SDIO Slave (we are not using SDIO, so it should be okay)
- To ensure the power supply to the ESP32 chip during power-up, it is advised to add an RC delay circuit at the EN pin. The recommended setting for the RC delay circuit is usually R = 10 kΩ and C = 1 µF. However, specific parameters should be adjusted based on the power-up timing of the SiP and the power-up and reset sequence timing of the chip.
  10k and 0.1uF gives 1ms time constant which satisfies the minimum delay required by the Power-Up Timing
- How to Flash:
  1) plug in USB-UART adapter
  2) Hold down BOOT button
  3) Press EN button once
  4) Once Device is detected in terminal, Release BOOT button
- MCU DECAPS
- (near C17) Ceramic capacitor (Low ESR, ESR<1ohm)
- RTC, CPU, and SDIO pins
- VDDA / VDDA3P3
- Dannon Sturn
- DWG. NO.
- REV.
- SHT.
- THIS DOCUMENT AND THE DATA DISCLOSED HEREIN OR HEREWITH IS THE PROPERTY OF ALTIUM LIMITED AND MAY BE FREELY DISTRIBUTED IN WHOLE. NO RIGHTS ARE RESERVED OR EXPRESS OR IMPLIED WARANTEE GIVEN.
- REVISION
- DESCRIPTION
- DATE
- APPROVED
- ENG:
- APPROVALS
- PROJECT
- DSN:
- CHK:
- REFERENCE DOCUMENTS
- PROJECT REVISION:
- TITLE
- DOCUMENT REVISION:
- DESIGN ITEM:
- BOM:
- FAB DWG:
- PCB DWG:
- ASSY DWG:
- SCALE:
- SIZE
- B
- CAGE CODE
- FILE NAME
- DWG NO.
- SHEET
- OF
- REV

### Library data of the parts
1-24 = Breakout Pin 0603: 0603 breakout pad; Part Number: Breakout Pin 0603
C13-C15 = CAP 0.1uF 50V: as C24 on sheet connectors; Value: 0.10uF; Part Number: CAP 0.1uF 50V
C16 = CAP 4.7uF 35V: CAP CER 4.7UF 35V X7R 0603/0805; Tolerance: 10%; Package: 0603/0805; Temperature Coefficient: X7R; Operating Temperature: -55°C ~ 125°C; Value: 4.7uF; Part Number: CAP 4.7uF 35V
C17-C23 = CAP 1.0uF 16V: CAP CER 1.0UF 16V X5R 0603/0805; Tolerance: 10%; Package: 0603/0805; Temperature Coefficient: X5R; Operating Temperature: -55°C ~ 85°C; Value: 1.0uF; Part Number: CAP 1.0uF 16V
J13 = 61300411121: Connector Header Through Hole 4 position 0.100 (2.54mm); MF: Wurth Electronics; SnapEDA_Link: https://www.snapeda.com/parts/61300411121/Wurth+Electronics+Inc./view-part/?ref=snap; Package: None; Value: *; MP: 61300411121; Check_prices: https://www.snapeda.com/parts/61300411121/Wurth+Electronics+Inc./view-part/?ref=eda
R13 R15 = RES 1k 1/8W: Default Resistor Symbol; Manufacturer Part Number 1: MCT06030C1001FP500; Power (Watts): 0.125W; Tolerance: 1%; Package: 0805; Value: 1k; Part Number: RES 1k 1/8W; Supplier 1: Digi-Key; Supplier Part Number 1: MCT0603-1.00K-CFCT-ND; Supplier URL 1: https://www.digikey.ca/en/products/detail/vishay-beyschlag-draloric-bc-components/MCT06030C1001FP500/2607821?s=N4IgTCBcDaILIGEAqAGAbCgzAWgIwDoUUBpbBAMWWwDkAREAXQF8g
R17 R23 = RES 10k 1/8W - 5%: RES SMD 10K OHM 5% 1/8W 0603; Power (Watts): 0.125W; Package: 0805; Value: 10k; Tolerance: 5%; Part Number: RES 10k 1/8W - 5%
R21 R22 = RES 4.7k 1/8W - 1%: Default Resistor Symbol; Manufacturer Part Number 1: RMCF0603FT4K70; Power (Watts): 0.125W; Tolerance: 1%; Package: 0805; Value: 4.7k; Part Number: RES 4.7k 1/8W - 1%; Supplier 1: Digi-Key; Supplier Part Number 1: RMCF0603FT4K70CT-ND; Supplier URL 1: https://www.digikey.ca/en/products/detail/stackpole-electronics-inc/RMCF0603FT4K70/1760998
S2 S3 = GT-TC029B-H025-L1N: JLC Supplied: 50mA 3.9mm 100MΩ 100,000 Times 12V 250gf 2.9mm 2.5mm Round Button; MP: EVP-AWCD4A; Package: None; Price: None; Value: *; Availability: Unavailable
SCL1 SDA1 = Test Point (Via): Part Number: Test Point (Via)
U4 = ESP32-PICO-D4: RX TXRX MOD WIFI SURFACE MOUNT; MF: Espressif Systems; MP: ESP32-PICO-D4; Package: SMD-48 Espressif Systems; Availability: Warning; Price: None; Purchase-URL: https://pricing.snapeda.com/search/part/ESP32-PICO-D4/?ref=eda; Check_prices: https://www.snapeda.com/parts/ESP32-PICO-D4/Espressif%20Systems/view-part/2762121/?ref=eda; SnapEDA_Link: https://www.snapeda.com/parts/ESP32-PICO-D4/Espressif%20Systems/view-part/2762121/?ref=snap; Value: *; Part Number: ESP32-PICO-D4; Manufacturer Part Number 1: ESP32-PICO-D4; Supplier 1: Digi-key; Supplier Part Number 1: 1904-1029-1-ND; Supplier URL 1: https://www.digikey.com/en/products/detail/espressif-systems/ESP32-PICO-D4/9381722
FL_RX1 FL_TX1 = Test Point (Via): Part Number: Test Point (Via)

## Nets that join several sheets
3V3: connectors (10 pins), MCU (20 pins)
5V_FLASH: power (D4.A), MCU (J13.01)
5V_PI: power (D4.C D5.C R9.2), connectors (10 pins), metal-detector (U2.4 U2.8)
GND: power (D2.C GND1.1 R3.2), connectors (42 pins), metal-detector (C12.1 U2.1), MCU (15 pins)
PGND: power (18 pins), connectors (6 pins)
VBAT: power (6 pins), connectors (7 pins)
I2C_SCL: connectors (J3.05), MCU (R22.1 SCL1.1 U4.39)
I2C_SDA: connectors (J3.03), MCU (R21.1 SDA1.1 U4.42)
MD_OUT: metal-detector (R25.1 U2.3), MCU (U4.6)
SCOIL_1: connectors (J10.1), metal-detector (R8.1 R25.2)
SCOIL_2: connectors (J10.2), metal-detector (C11.2)
T_FG1: connectors (U5.21), MCU (U4.15)
T_FG2: connectors (U5.20), MCU (U4.29)
T_FG3: connectors (U5.19), MCU (U4.24)
T_FG4: connectors (U5.18), MCU (U4.35)
T_FG5: connectors (U5.17), MCU (U4.36)
T_FG6: connectors (U5.16), MCU (U4.7)

## Assembly variants
DNP: not fitted R24